# Altium schematic sheet rs485.SchDoc
size 228 x 165 mm; SheetNumber: 3; SheetTotal: 7
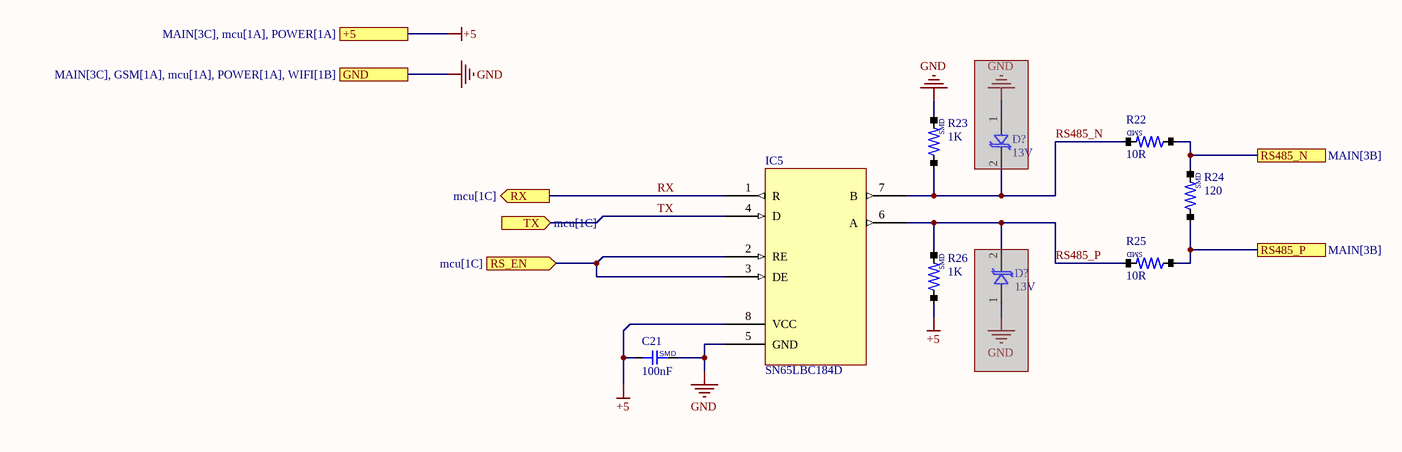
[diagram p0: rs485.SchDoc]

## Parts
(Parts that share a designator on the sheet are numbered #1, #2 ... from top to bottom, then left to right.)
C21  100nF  [CAP-0603]
D?#1  13V  [TVS-5V-SMD]  (masked out: inside a compile mask, not in the netlist)
D?#2  13V  [TVS-5V-SMD]  (masked out: inside a compile mask, not in the netlist)
IC5  SN65LBC184D  [SOP-8]
R22  10R  [RES/1206]
R23  1K  [RES/0603]
R24  120  [RES/1206]
R25  10R  [RES/1206]
R26  1K  [RES/0603]

## Ports
+5 (see MAIN[3C], mcu[1A], POWER[1A]), GND (see MAIN[3C], GSM[1A], mcu[1A], POWER[1A], WIFI[1B]), RS485_N (see MAIN[3B]), RS485_P (see MAIN[3B]), RS_EN (in, see mcu[1C]), RX (out, see mcu[1C]), TX (in, see mcu[1C])

## Nets
+5: C21.1 IC5.8(VCC) R26.1 ; port +5
GND: C21.2 IC5.5(GND) R23.2 ; port GND
RS485_N: IC5.7(B) R22.2 R23.1
RS485_N: R22.1 R24.2 ; port RS485_N  [a separate net that carries the same name]
RS485_P: IC5.6(A) R25.2 R26.2
RS485_P: R24.1 R25.1 ; port RS485_P  [a separate net that carries the same name]
RS_EN: IC5.2(RE) IC5.3(DE) ; port RS_EN
RX: IC5.1(R) ; port RX
TX: IC5.4(D) ; port TX

## Notes on the sheet
- (in symbol cap_smd) SMD
- (in symbol RES/SMD) SMD

## Library data of the parts
C21 = cap_smd
D?#1 D?#2 = TVS-SMD
R22-R26 = RES/SMD